# EAGLE design ringmod (EAGLE 7.4.0)

## Sheet 1 of 2
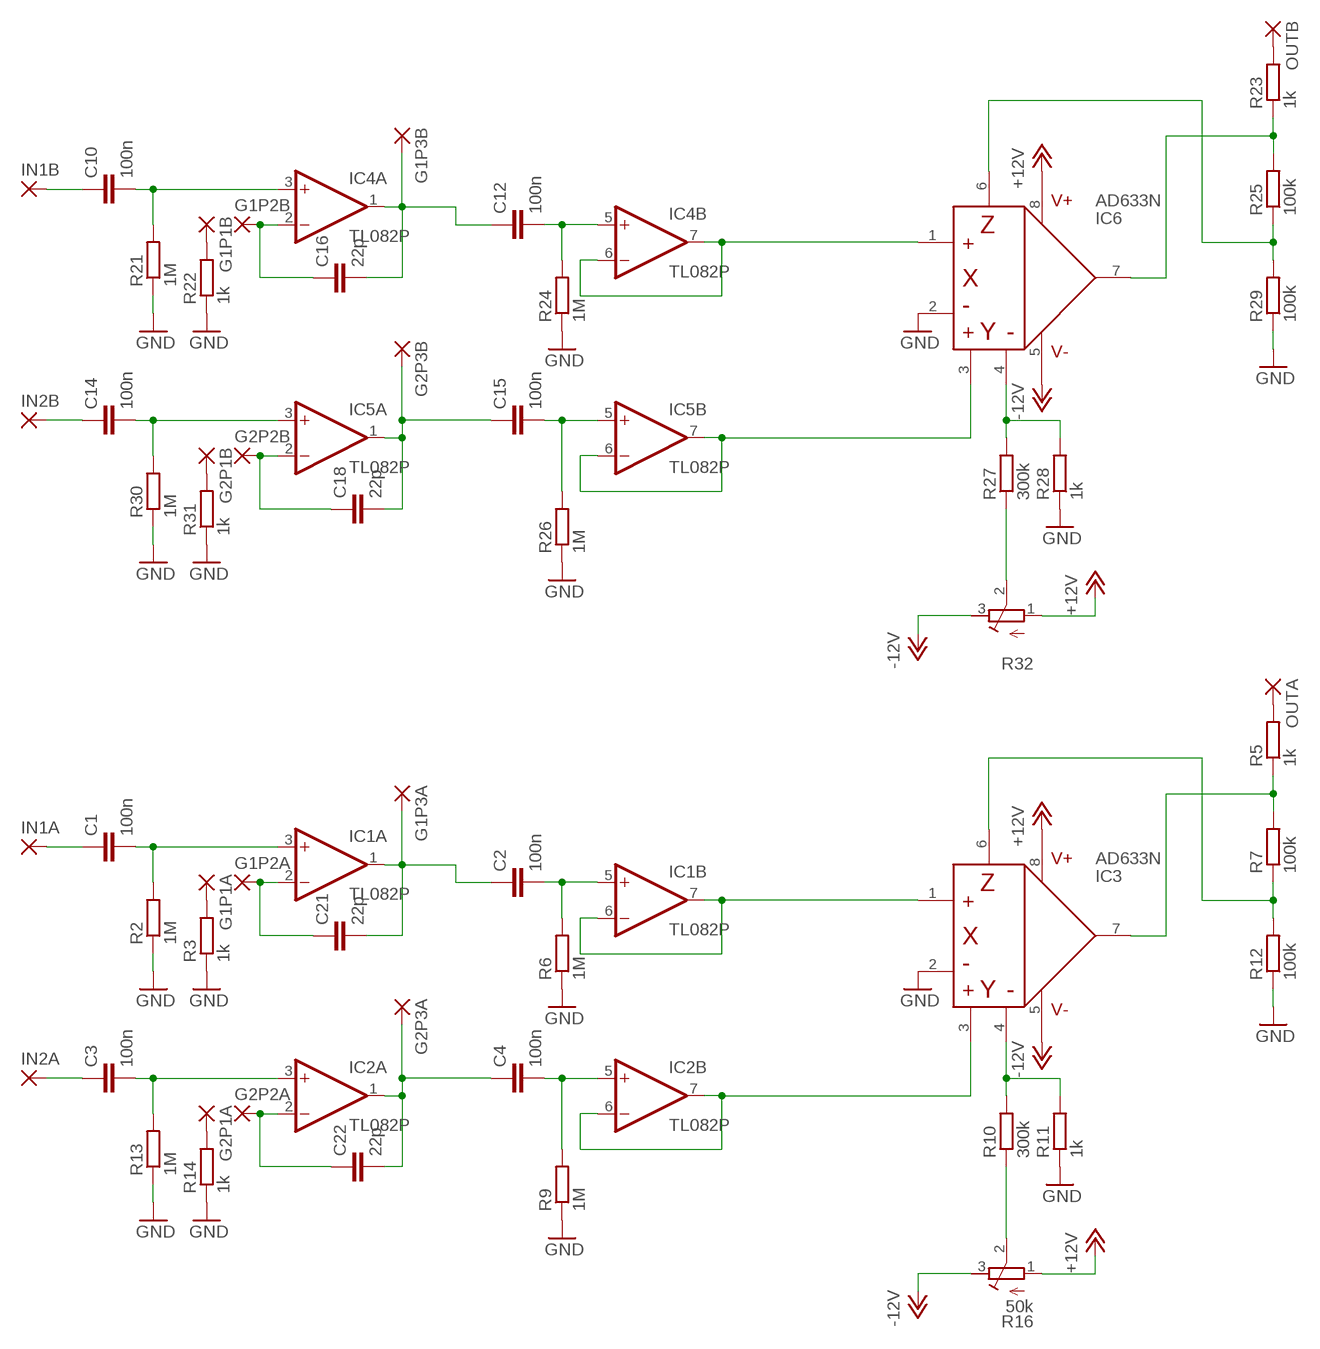
[diagram p0: schematic, sheet 1]

### Parts
C1  100n  C-EU050-035X075  [C050-035X075]
C2  100n  C-EU050-035X075  [C050-035X075]
C3  100n  C-EU050-035X075  [C050-035X075]
C4  100n  C-EU050-035X075  [C050-035X075]
C10  100n  C-EU050-035X075  [C050-035X075]
C12  100n  C-EU050-035X075  [C050-035X075]
C14  100n  C-EU050-035X075  [C050-035X075]
C15  100n  C-EU050-035X075  [C050-035X075]
C16  22p  C-EU050-035X075  [C050-035X075]
C18  22p  C-EU050-035X075  [C050-035X075]
C21  22p  C-EU050-035X075  [C050-035X075]
C22  22p  C-EU050-035X075  [C050-035X075]
G1P1A  2,54/1,0  [2,54/1,0]
G1P1B  2,54/1,0  [2,54/1,0]
G1P2A  2,54/1,0  [2,54/1,0]
G1P2B  2,54/1,0  [2,54/1,0]
G1P3A  2,54/1,0  [2,54/1,0]
G1P3B  2,54/1,0  [2,54/1,0]
G2P1A  2,54/1,0  [2,54/1,0]
G2P1B  2,54/1,0  [2,54/1,0]
G2P2A  2,54/1,0  [2,54/1,0]
G2P2B  2,54/1,0  [2,54/1,0]
G2P3A  2,54/1,0  [2,54/1,0]
G2P3B  2,54/1,0  [2,54/1,0]
IC1  TL082P  [DIL08]
IC2  TL082P  [DIL08]
IC3  AD633N  [DIL08]
IC4  TL082P  [DIL08]
IC5  TL082P  [DIL08]
IC6  AD633N  [DIL08]
IN1A  2,54/1,0  [2,54/1,0]
IN1B  2,54/1,0  [2,54/1,0]
IN2A  2,54/1,0  [2,54/1,0]
IN2B  2,54/1,0  [2,54/1,0]
OUTA  2,54/1,0  [2,54/1,0]
OUTB  2,54/1,0  [2,54/1,0]
R2  1M  R-EU_0309/10  [0309/10]
R3  1k  R-EU_0309/10  [0309/10]
R5  1k  R-EU_0309/10  [0309/10]
R6  1M  R-EU_0309/10  [0309/10]
R7  100k  R-EU_0309/10  [0309/10]
R9  1M  R-EU_0309/10  [0309/10]
R10  300k  R-EU_0309/10  [0309/10]
R11  1k  R-EU_0309/10  [0309/10]
R12  100k  R-EU_0309/10  [0309/10]
R13  1M  R-EU_0309/10  [0309/10]
R14  1k  R-EU_0309/10  [0309/10]
R16  50k  R-TRIMM64W  [RTRIM64W]
R21  1M  R-EU_0309/10  [0309/10]
R22  1k  R-EU_0309/10  [0309/10]
R23  1k  R-EU_0309/10  [0309/10]
R24  1M  R-EU_0309/10  [0309/10]
R25  100k  R-EU_0309/10  [0309/10]
R26  1M  R-EU_0309/10  [0309/10]
R27  300k  R-EU_0309/10  [0309/10]
R28  1k  R-EU_0309/10  [0309/10]
R29  100k  R-EU_0309/10  [0309/10]
R30  1M  R-EU_0309/10  [0309/10]
R31  1k  R-EU_0309/10  [0309/10]
R32  R-TRIMM64W  [RTRIM64W]

### Nets
+12V: IC3.8 IC6.8 R16.1(A) R32.1(A) ; also sheet 2
-12V: IC3.5 IC6.5 R16.3(E) R32.3(E) ; also sheet 2
GND: IC3.2 IC6.2 R2.1 R3.1 R6.1 R9.1 R11.1 R12.1 R13.1 R14.1 R21.1 R22.1 R24.1 R26.1 R28.1 R29.1 R30.1 R31.1 ; also sheet 2
N$1: C2.1 C21.2 G1P3A.1(P) IC1.1(A:OUT)
N$2: C21.1 G1P2A.1(P) IC1.2(A:-IN)
N$3: G1P1A.1(P) R3.2
N$4: C1.1 IN1A.1(P)
N$5: C1.2 IC1.3(A:+IN) R2.2
N$6: IC1.6(B:-IN) IC1.7(B:OUT) IC3.1
N$7: C2.2 IC1.5(B:+IN) R6.2
N$8: C3.1 IN2A.1(P)
N$9: C3.2 IC2.3(A:+IN) R13.2
N$10: C4.1 C22.2 G2P3A.1(P) IC2.1(A:OUT)
N$11: C22.1 G2P2A.1(P) IC2.2(A:-IN)
N$12: G2P1A.1(P) R14.2
N$13: C4.2 IC2.5(B:+IN) R9.2
N$14: IC2.6(B:-IN) IC2.7(B:OUT) IC3.3
N$15: IC3.4 R10.2 R11.2
N$16: R10.1 R16.2(S)
N$17: IC3.6 R7.1 R12.2
N$18: IC3.7 R5.1 R7.2
N$19: OUTA.1(P) R5.2
N$20: C12.1 C16.2 G1P3B.1(P) IC4.1(A:OUT)
N$21: C16.1 G1P2B.1(P) IC4.2(A:-IN)
N$22: G1P1B.1(P) R22.2
N$23: C10.1 IN1B.1(P)
N$24: C10.2 IC4.3(A:+IN) R21.2
N$25: IC4.6(B:-IN) IC4.7(B:OUT) IC6.1
N$26: C12.2 IC4.5(B:+IN) R24.2
N$27: C14.1 IN2B.1(P)
N$28: C14.2 IC5.3(A:+IN) R30.2
N$29: C15.1 C18.2 G2P3B.1(P) IC5.1(A:OUT)
N$30: C18.1 G2P2B.1(P) IC5.2(A:-IN)
N$31: G2P1B.1(P) R31.2
N$32: C15.2 IC5.5(B:+IN) R26.2
N$33: IC5.6(B:-IN) IC5.7(B:OUT) IC6.3
N$34: IC6.4 R27.2 R28.2
N$35: R27.1 R32.2(S)
N$36: IC6.6 R25.1 R29.2
N$37: IC6.7 R23.1 R25.2
N$38: OUTB.1(P) R23.2

## Sheet 2 of 2
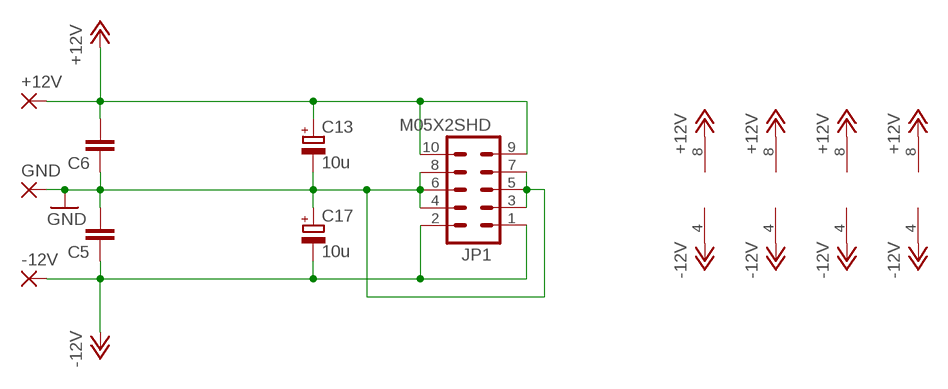
[diagram p1: schematic, sheet 2]

### Parts
+12V  2,54/1,0  [2,54/1,0]
-12V  2,54/1,0  [2,54/1,0]
C5  C-EU050-035X075  [C050-035X075]
C6  C-EU050-035X075  [C050-035X075]
C13  10u  CPOL-EUE3.5-8  [E3,5-8]
C17  10u  CPOL-EUE3.5-8  [E3,5-8]
GND  2,54/1,0  [2,54/1,0]
JP1  M05X2SHD  [2X5-SHROUDED]

### Nets
+12V: +12V.1(P) C6.2 C13.+ IC1.8(P:V+) IC2.8(P:V+) IC4.8(P:V+) IC5.8(P:V+) JP1.9 JP1.10 ; also sheet 1
-12V: -12V.1(P) C5.1 C17.- IC1.4(P:V-) IC2.4(P:V-) IC4.4(P:V-) IC5.4(P:V-) JP1.1 JP1.2 ; also sheet 1
GND: C5.2 C6.1 C13.- C17.+ GND.1(P) JP1.3 JP1.4 JP1.5 JP1.6 JP1.7 JP1.8 ; also sheet 1

## Library data of the parts
+12V -12V G1P1A G1P1B G1P2A G1P2B G1P3A G1P3B G2P1A G2P1B G2P2A G2P2B G2P3A G2P3B GND IN1A IN1B IN2A IN2B OUTA OUTB = wirepad:2,54/1,0: THROUGH-HOLE PAD
C1-C6 C10 C12 C14-C16 C18 C21 C22 = rcl:C-EU: CAPACITOR, European symbol
C13 C17 = rcl:CPOL-EU: POLARIZED CAPACITOR, European symbol
IC1 IC2 IC4 IC5 = cavalier:TL082: OP AMP
IC3 IC6 = synthdiy:AD633: AD633 Multiplier (X*Y)/(10*Z)
JP1 = SparkFun:M05X2: Header 5x2 Standard 10-pin dual row 0.1" header. Commonly used with AVR-ISP. Use with Spark Fun Electronics SKU: PRT-00778
R2 R3 R5-R7 R9-R14 R21-R31 = rcl:R-EU_: RESISTOR, European symbol
R16 R32 = rcl:R-TRIMM: Trimm resistor

## Board
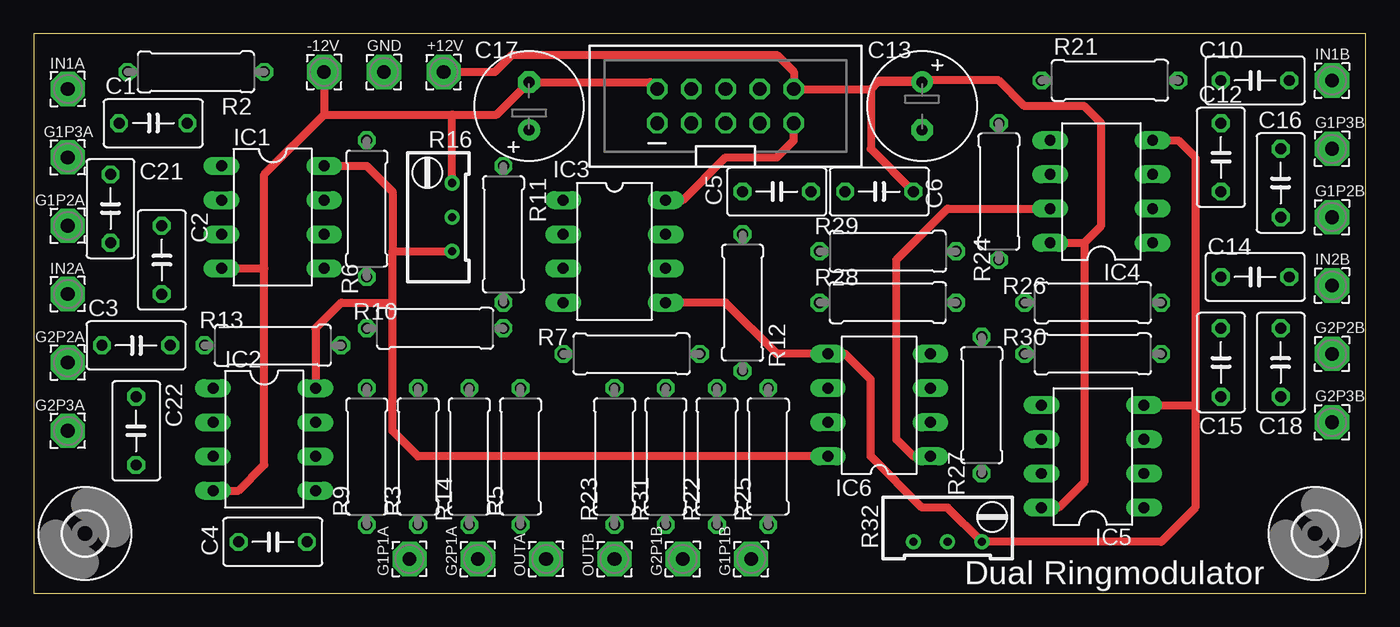
[diagram p2: board, top side]
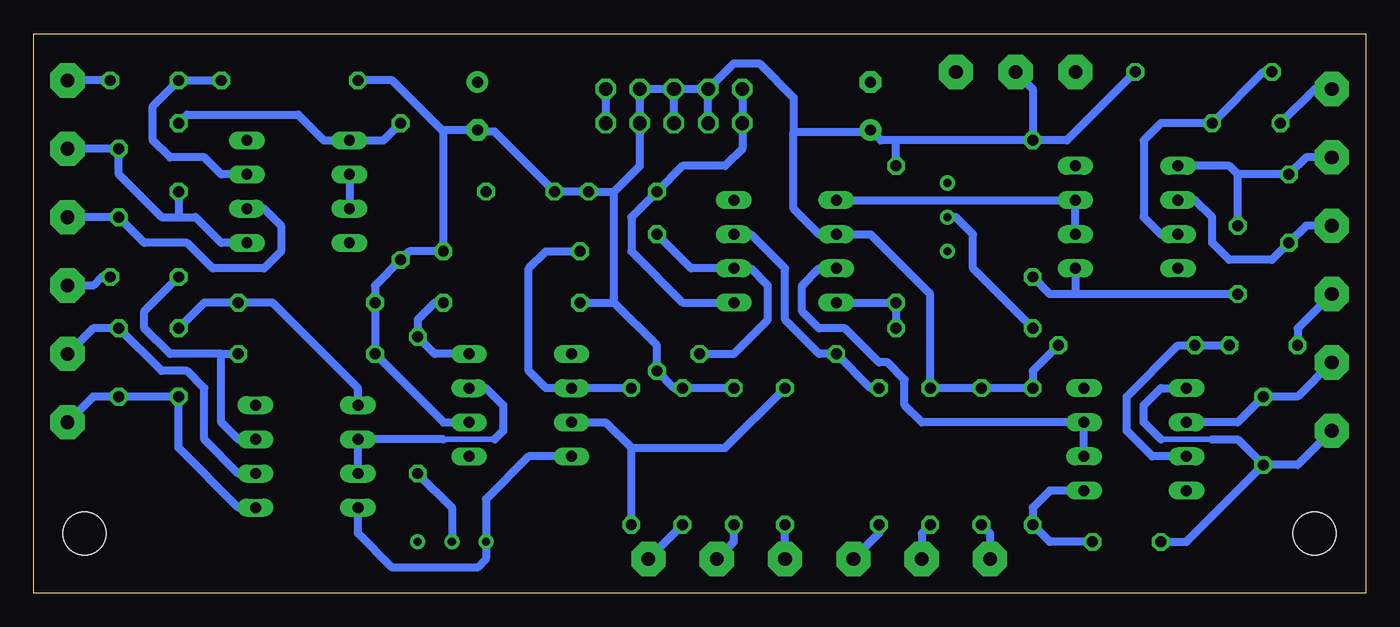
[diagram p3: board, bottom side, seen from below]

Size 99.04 x 41.58 mm. Coordinates in mm from the lower left corner, seen from the top.
Outline: 0,0 99.04,0 99.04,41.58 0,41.58 0,0
Copper layers (1*16): Top 0.035mm / dielectric 1.5mm / Bottom 0.035mm
Design rules "default": minimum track width 10mil, minimum drill 24mil, track to track 8mil, track to pad 8mil, pad to pad 8mil, via to via 8mil, smd to smd 8mil, copper to edge 40mil, drill to drill 8mil, minimum pad ring 10mil, minimum via ring 8mil, stop-mask expansion 4mil, vias tented up to drill 0mil, thermal gap 10mil

### Footprints (pad centres in the part's own frame; a part is rotated, then mirrored left to right if it is on the bottom)
2,54/1,0 = drill 1.016 pad 2.54 octagon: 1 0,0
C050-035X075 = drill 0.813 octagon: 1 -2.54,0; 2 2.54,0
E3,5-8 = drill 0.813 pad 1.6: + -1.778,0 | drill 0.813 pad 1.6 octagon: - 1.778,0
DIL08 = drill 0.813 pad 1.27 long: 1 -3.81,-3.81; 2 -1.27,-3.81; 3 1.27,-3.81; 4 3.81,-3.81; 5 3.81,3.81; 6 1.27,3.81; 7 -1.27,3.81; 8 -3.81,3.81
DIL08' = drill 0.813 long: 1 -3.81,-3.81; 2 -1.27,-3.81; 3 1.27,-3.81; 4 3.81,-3.81; 5 3.81,3.81; 6 1.27,3.81; 7 -1.27,3.81; 8 -3.81,3.81
2X5-SHROUDED = drill 1.016 octagon: 1 -1.27,5.08; 2 1.27,5.08; 3 -1.27,2.54; 4 1.27,2.54; 5 -1.27,0; 6 1.27,0; 7 -1.27,-2.54; 8 1.27,-2.54; 9 -1.27,-5.08; 10 1.27,-5.08
0309/10 = drill 0.813 octagon: 1 -5.08,0; 2 5.08,0
RTRIM64W = drill 0.61: 1 1.27,-2.54; 2 1.27,0; 3 1.27,2.54
3,2 = hole 3.2: 0,0

### Placement (x,y rotation side)
+12V  30.48,38.73 0 top
-12V  21.59,38.73 0 top
C1  8.89,34.92 0 top
C2  9.53,24.77 270 top
C3  7.62,18.41 0 top
C4  17.78,3.81 0 top
C5  55.24,29.84 0 top
C6  62.87,29.84 0 top
C10  90.81,38.1 180 top
C12  88.27,32.38 90 top
C13  66.04,36.2 270 top
C14  90.81,23.5 180 top
C15  88.27,17.14 90 top
C16  92.71,30.48 90 top
C17  36.83,36.2 90 top
C18  92.71,17.14 270 top
C21  5.71,28.57 90 top
C22  7.62,12.06 270 top
G1P1A  27.94,2.54 90 top
G1P1B  53.34,2.54 0 top
G1P2A  2.54,27.3 90 top
G1P2B  96.52,27.94 0 top
G1P3A  2.54,32.38 90 top
G1P3B  96.52,33.02 0 top
G2P1A  33.02,2.54 90 top
G2P1B  48.26,2.54 0 top
G2P2A  2.54,17.14 90 top
G2P2B  96.52,17.78 0 top
G2P3A  2.54,12.06 90 top
G2P3B  96.52,12.7 0 top
GND  26.04,38.73 0 top
IC1  17.78,27.94 270 top
IC2  17.14,11.43 270 top
IC3  AD633N  [DIL08']  43.18,25.4 270 top
IC4  79.38,29.84 90 top
IC5  78.74,10.16 90 top
IC6  AD633N  [DIL08']  62.87,13.97 90 top
IN1A  2.54,37.47 90 top
IN1B  96.52,38.1 0 top
IN2A  2.54,22.23 90 top
IN2B  96.52,22.86 0 top
JP1  51.44,36.2 90 top
OUTA  38.1,2.54 90 top
OUTB  43.18,2.54 0 top
R2  12.06,38.73 180 top
R3  28.57,10.16 270 top
R5  36.2,10.16 270 top
R6  24.77,28.57 270 top
R7  44.45,17.78 180 top
R9  24.77,10.16 270 top
R10  29.84,19.68 0 top
R11  34.92,26.67 270 top
R12  52.7,21.59 90 top
R13  17.78,18.41 180 top
R14  32.38,10.16 270 top
R16  29.84,27.94 0 top
R21  80.01,38.1 0 top
R22  50.8,10.16 270 top
R23  43.18,10.16 270 top
R24  71.75,29.84 90 top
R25  54.61,10.16 270 top
R26  78.74,21.59 0 top
R27  70.48,13.97 90 top
R28  63.5,21.59 0 top
R29  63.5,25.4 180 top
R30  78.74,17.78 0 top
R31  46.99,10.16 270 top
R32  67.94,5.08 270 top
U$1  [3,2]  3.81,4.45 0 top
U$2  [3,2]  95.25,4.45 0 top

### Tracks (layer width: path | path; a pad name or v marks a point on that pad's centre or on a via)
+12V
  Top 0.61: +12V.1 34.29,38.73 35.56,40.01 55.24,40.01 56.52,38.73 JP1.10 62.23,37.47 | IC3.8 48.26,29.21 51.44,32.38 55.24,32.38 56.52,33.66 JP1.9 | 62.74,37.97 62.87,38.1 65.91,38.1 C13.+ | C13.+ 62.74,37.97 | 62.74,37.97 62.23,37.47 | 62.23,37.47 62.23,33.02 C6.2 | 78.11,26.04 79.38,27.3 79.38,34.92 78.11,36.2 73.66,36.2 71.75,38.1 66.17,38.1 C13.+ | IC2.8 20.95,19.68 22.86,21.59 26.67,21.59 | 78.11,26.04 78.11,8.26 76.2,6.35 IC5.8 | IC1.8 24.77,31.75 26.67,29.84 26.67,25.4 | IC4.8 78.11,26.04 | 26.67,25.4 R16.1 | 26.67,21.59 26.67,25.4 | IC6.8 28.57,10.16 26.67,12.06 26.67,21.59
  Bottom 0.61: IC5.8 74.93,4.45 72.39,1.91 66.04,1.91 65.41,2.54 R32.1 65.41,6.99 62.23,10.16 IC6.8 | JP1.10 JP1.9
-12V
  Top 0.61: IC2.4 15.24,7.62 17.14,9.53 17.14,24.13 | 17.14,24.13 17.14,31.11 21.59,35.56 | IC1.4 17.14,24.13 | 21.59,35.56 31.11,35.56 | 31.11,35.56 34.42,35.56 C17.- 45.85,37.97 JP1.2 | R16.3 31.11,35.56 | -12V.1 21.59,35.56 | IC4.4 85.09,33.66 86.36,32.38 86.36,13.97 | 86.36,13.97 86.36,6.35 83.82,3.81 R32.3 67.94,6.35 66.04,6.35 62.23,10.16 62.23,15.88 60.33,17.78 IC6.5 55.24,17.78 51.44,21.59 IC3.5 | IC5.4 86.36,13.97
  Bottom 0.61: JP1.2 JP1.1 46.35,33.02 47.62,31.75 50.8,31.75 C5.1 54.61,27.94 54.61,25.4 50.8,21.59 IC3.5
GND
  Bottom 0.61: R31.1 R22.1 51.44,15.24 R12.1 52.7,18.41 55.88,21.59 | R28.1 55.88,21.59 | 55.88,21.59 55.88,29.84 | 55.88,29.84 53.98,31.75 JP1.7 JP1.8 JP1.6 | JP1.5 JP1.6 | JP1.3 JP1.4 | JP1.4 JP1.6 | 55.88,29.84 C5.2 C6.1 64.77,34.29 65.91,34.29 C13.- 68.45,34.42 68.58,34.29 | IC6.2 68.58,12.7 R30.1 R26.1 73.66,22.86 R24.1 71.12,25.4 R29.1 68.58,34.29 | R13.1 24.77,16.51 R9.1 R3.1 R14.1 32.38,22.23 36.83,26.67 IC3.2 40.64,26.67 42.55,28.57 42.55,34.29 | GND.1 24.77,37.47 R6.1 | R6.1 34.92,33.66 | 34.92,33.66 36.07,33.66 C17.+ 36.96,34.29 42.55,34.29 | JP1.4 46.99,39.37 45.09,39.37 42.55,36.83 42.55,34.29 | R2.1 22.23,33.66 R6.1 | R11.1 34.92,33.66 | 68.58,34.29 72.39,38.1 R21.1
N$1
  Bottom 0.61: G1P3A.1 4.45,32.38 C21.2 9.53,31.11 | 9.53,31.11 10.16,31.75 IC1.1 | C2.1 9.53,31.11
N$2
  Bottom 0.61: G1P2A.1 4.45,27.3 C21.1 6.99,24.77 10.16,24.77 11.43,26.04 11.43,27.94 12.7,29.21 IC1.2
N$3
  Bottom 0.61: R3.2 27.94,4.45 G1P1A.1
N$4
  Bottom 0.61: IN1A.1 3.81,37.47 C1.1
N$5
  Bottom 0.61: R2.2 7.62,38.73 C1.2 15.24,34.92 16.51,33.66 16.51,27.94 15.24,26.67 IC1.3
N$6
  Bottom 0.61: IC1.6 IC1.7 IC3.1
N$7
  Bottom 0.61: C2.2 21.59,22.23 | 21.59,22.23 23.5,22.23 R6.2 | IC1.5 21.59,22.23
N$8
  Bottom 0.61: IN2A.1 5.08,19.68 C3.1
N$9
  Bottom 0.61: C3.2 R13.2 13.97,18.41 17.78,14.61 17.78,12.06 15.88,10.16 IC2.3
N$10
  Bottom 0.406: 11.43,11.43 15.24,11.43
  Bottom 0.61: G2P3A.1 5.08,9.53 C22.2 | 15.24,11.43 16.51,12.7 16.51,13.97 15.24,15.24 IC2.1 | C4.1 13.34,3.81 C22.2 | 11.43,11.43 9.53,11.43 C22.2
N$11
  Bottom 0.61: G2P2A.1 5.08,14.61 C22.1 9.53,12.7 IC2.2
N$12
  Bottom 0.61: R14.2 33.02,4.45 G2P1A.1
N$13
  Bottom 0.61: C4.2 23.5,3.81 R9.2 24.77,6.35 23.5,7.62 IC2.5
N$14
  Bottom 0.61: IC2.6 IC2.7 33.02,12.7 34.29,13.97 34.29,15.88 35.56,17.14 36.2,17.14 38.73,19.68 40.64,19.68 41.91,20.95 41.91,22.86 40.64,24.13 IC3.3
N$15
  Bottom 0.61: IC3.4 R11.2 R10.2
N$16
  Bottom 0.61: R10.1 29.21,24.13 29.21,26.67 30.48,27.94 R16.2
N$17
  Bottom 0.61: R7.1 46.99,17.78 44.45,20.32 44.45,22.86 45.72,24.13 IC3.6 50.16,24.13 R12.2
N$18
  Bottom 0.61: R5.1 36.83,15.24 R7.2 40.64,17.78 43.18,20.32 43.18,24.13 45.72,26.67 IC3.7
N$19
  Bottom 0.61: R5.2 36.2,4.45 OUTA.1
N$20
  Bottom 0.61: IC4.1 85.09,26.04 87,27.94 88.27,27.94 | G1P3B.1 C16.2 92.71,31.11 89.53,27.94 88.27,27.94 | C12.1 88.27,27.94
N$21
  Bottom 0.61: IC4.2 81.92,28.57 80.64,27.3 80.64,25.4 81.92,24.13 85.72,24.13 87.63,26.04 90.81,26.04 C16.1 G1P2B.1
N$22
  Bottom 0.61: G1P1B.1 R22.2
N$23
  Bottom 0.61: C10.1 IN1B.1
N$24
  Bottom 0.61: IC4.3 85.09,31.11 86.36,32.38 88.9,32.38 90.17,33.66 90.17,36.2 C10.2 R21.2
N$25
  Top 0.61: IC6.1 65.41,10.16 64.14,11.43 64.14,24.77 67.94,28.57 IC4.7
  Bottom 0.61: IC4.6 IC4.7
N$26
  Bottom 0.61: C12.2 87.63,35.56 79.38,35.56 77.47,33.66 IC4.5 73.03,33.66 R24.2
N$27
  Bottom 0.61: C14.1 93.98,23.5 94.61,22.86 IN2B.1
N$28
  Bottom 0.61: IC5.3 83.82,11.43 85.09,12.7 85.09,17.78 | 85.09,17.78 88.9,17.78 90.81,19.68 90.81,20.95 C14.2 | 85.09,17.78 R30.2
N$29
  Bottom 0.61: IC5.1 83.82,6.35 88.27,10.79 C15.1 C18.2 94.61,14.61 G2P3B.1
N$30
  Bottom 0.61: IC5.2 83.82,8.89 86.36,11.43 86.36,15.24 87.63,16.51 89.53,16.51 C18.1 94.61,19.68 G2P2B.1
N$31
  Bottom 0.61: G2P1B.1 46.99,3.81 R31.2
N$32
  Bottom 0.61: C15.2 86.36,21.59 R26.2 81.28,21.59 74.93,15.24 IC5.5
N$33
  Bottom 0.406: 64.77,11.43 68.58,11.43
  Bottom 0.61: IC6.3 65.41,15.24 64.14,13.97 64.14,12.06 64.77,11.43 | 68.58,11.43 IC5.6 IC5.7
N$34
  Bottom 0.61: IC6.4 69.22,17.78 R27.2 70.48,20.32 69.22,21.59 R28.2
N$35
  Bottom 0.61: R27.1 67.94,6.35 R32.2
N$36
  Bottom 0.61: R29.2 60.96,25.4 62.23,24.13 62.23,16.51 60.96,15.24 IC6.6 R25.1
N$37
  Bottom 0.61: IC6.7 56.52,12.7 54.61,10.79 | R25.2 54.61,10.79 | 54.61,10.79 47.62,10.79 R23.1
N$38
  Bottom 0.61: OUTB.1 R23.2

### Text on the board
tNames: Dual Ringmodulator